# EAGLE design hello-soldering-0.3 (EAGLE 9.2.0)
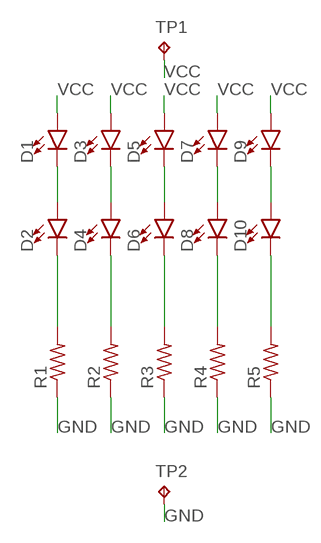
[diagram p0: schematic, sheet 1]

## Parts
D1  LED1206  [LED-1206]
D2  LED1206  [LED-1206]
D3  LED1206  [LED-1206]
D4  LED1206  [LED-1206]
D5  LED1206  [LED-1206]
D6  LED1206  [LED-1206]
D7  LED1206  [LED-1206]
D8  LED1206  [LED-1206]
D9  LED1206  [LED-1206]
D10  LED1206  [LED-1206]
R1  RES-US1206  [R1206]
R2  RES-US1206  [R1206]
R3  RES-US1206  [R1206]
R4  RES-US1206  [R1206]
R5  RES-US1206  [R1206]
TP1  TPTP20R  [TP20R]
TP2  TPTP20R  [TP20R]

## Nets
GND: R1.1 R2.1 R3.1 R4.1 R5.1 TP2.TP
N$1: D1.C D2.A
N$2: D2.C R1.2
N$3: D3.C D4.A
N$4: D4.C R2.2
N$5: D5.C D6.A
N$6: D6.C R3.2
N$7: D8.C R4.2
N$8: D10.C R5.2
N$9: D7.C D8.A
N$10: D9.C D10.A
VCC: D1.A D3.A D5.A D7.A D9.A TP1.TP

## Library data of the parts
D1-D10 = SparkFun-LED:LED: LED (Generic) Standard schematic elements and footprints for 5mm, 3mm, 1206, and 0603 sized LEDs. Generic LEDs with no color specified.
R1-R5 = fab:RES-US: Resistor (US Symbol) Variants with postfix FAB are widened to allow the routing of internal traces
TP1 TP2 = testpad:TP: Test pad

## Board
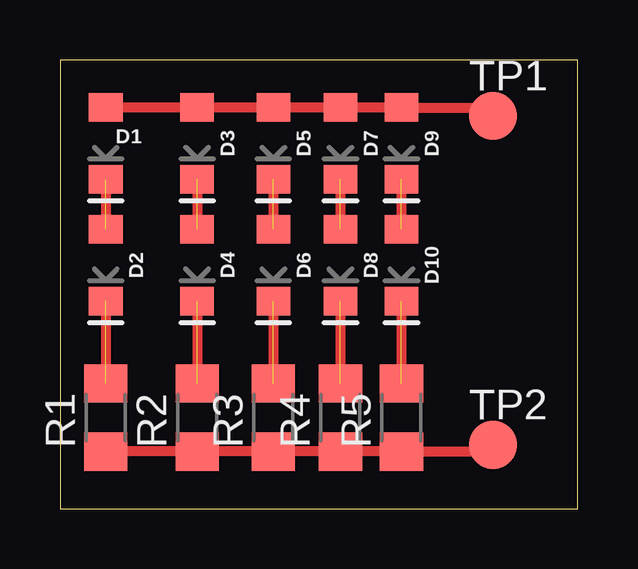
[diagram p1: board, top side]

Size 21.57 x 18.72 mm. Coordinates in mm from the lower left corner, seen from the top.
Outline: 0,0 21.57,0 21.57,18.72 0,18.72 0,0
Copper layers (1*16): Top 0.035mm / dielectric 1.5mm / Bottom 0.035mm
Design rules "default": minimum track width 6mil, minimum drill 0.35mm, track to track 6mil, track to pad 6mil, pad to pad 6mil, via to via 6mil, smd to smd 6mil, copper to edge 40mil, drill to drill 6mil, minimum pad ring 10mil, minimum via ring 8mil, stop-mask expansion 4mil, vias tented up to drill 0mil, thermal gap 10mil

### Footprints (pad centres in the part's own frame; a part is rotated, then mirrored left to right if it is on the bottom)
LED-1206 = smd 1.2 x 1.4: A -1.5,0; C 1.5,0
R1206 = smd 1.6 x 1.803: 1 -1.422,0; 2 1.422,0
TP20R = smd 2 x 2: TP 0,0

### Placement (x,y rotation side)
D1  1.91,15.24 270 top
D2  1.91,10.16 270 top
D3  5.71,15.24 270 top
D4  5.71,10.16 270 top
D5  8.89,15.24 270 top
D6  8.89,10.16 270 top
D7  11.68,15.24 270 top
D8  11.68,10.16 270 top
D9  14.22,15.24 270 top
D10  14.22,10.16 270 top
R1  1.91,3.81 90 top
R2  5.71,3.81 90 top
R3  8.89,3.81 90 top
R4  11.68,3.81 90 top
R5  14.22,3.81 90 top
TP1  18.03,16.38 0 top
TP2  18.03,2.67 0 top

### Tracks (layer width: path | path; a pad name or v marks a point on that pad's centre or on a via)
GND
  Top 0.406: R1.1 R2.1 R3.1 | R3.1 R4.1 R5.1 17.75,2.39 TP2.TP | 9.04,2.54 R3.1
N$1  (2 unrouted)
  Top 0.406: D1.C D2.A
N$2  (2 unrouted)
  Top 0.406: D2.C R1.2
N$3  (2 unrouted)
  Top 0.406: D3.C D4.A
N$4  (2 unrouted)
  Top 0.406: D4.C R2.2
N$5  (2 unrouted)
  Top 0.406: D5.C D6.A
N$6  (2 unrouted)
  Top 0.406: D6.C R3.2
N$7  (2 unrouted)
  Top 0.406: D8.C R4.2
N$8  (2 unrouted)
  Top 0.406: D10.C R5.2
N$9  (2 unrouted)
  Top 0.406: D7.C D8.A
N$10  (2 unrouted)
  Top 0.406: D9.C D10.A
VCC
  Top 0.152: D3.A D5.A D7.A
  Top 0.406: D1.A D3.A D7.A D9.A 17.68,16.74 TP1.TP | 9.12,16.51 D5.A